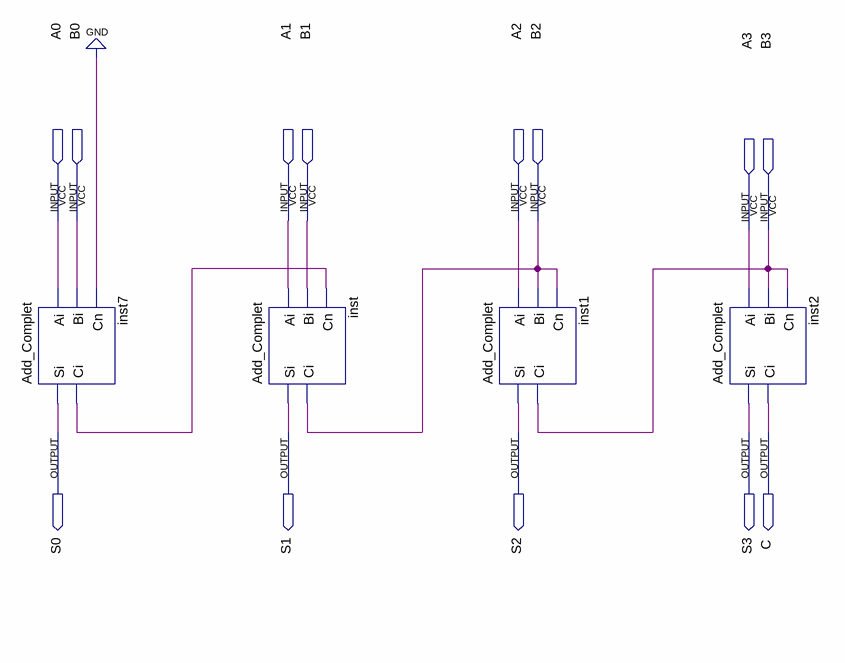
[diagram p0: schematic sheet]
// Quartus schematic Add-4bit-2.bdf as structural Verilog: 4 symbols, 13 pins
module \Add-4bit-2  (
  input  A0,
  input  B0,
  input  A1,
  input  B1,
  input  A2,
  input  B2,
  input  A3,
  input  B3,
  output S0,
  output S1,
  output S2,
  output S3,
  output C
);

  wire inst7_ci;

  Add_Complet inst7 (.Ai(A0), .Bi(B0), .Cn(1'b0), .Si(S0), .Ci(inst7_ci));
  Add_Complet inst (.Ai(A1), .Bi(B1), .Cn(inst7_ci), .Si(S1), .Ci(B2));
  Add_Complet inst1 (.Ai(A2), .Bi(B2), .Cn(B2), .Si(S2), .Ci(B3));
  Add_Complet inst2 (.Ai(A3), .Bi(B3), .Cn(B3), .Si(S3), .Ci(C));
endmodule
